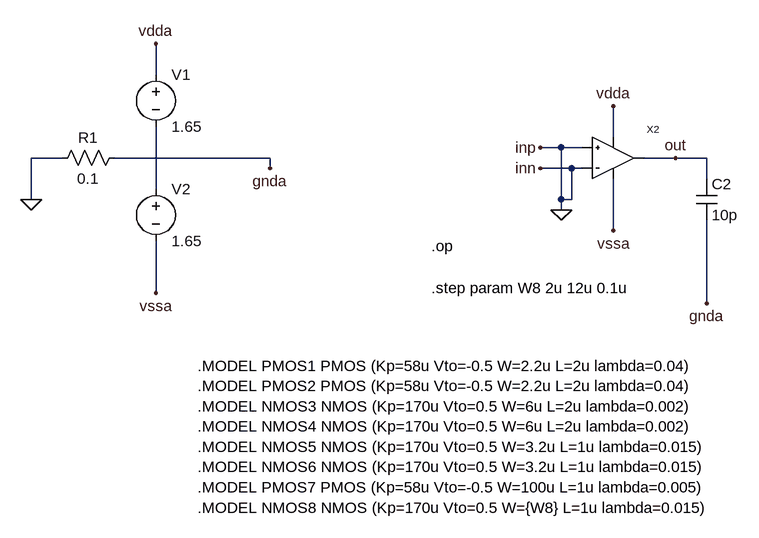
[diagram p0: schematic CMOSopamp-top.asc]
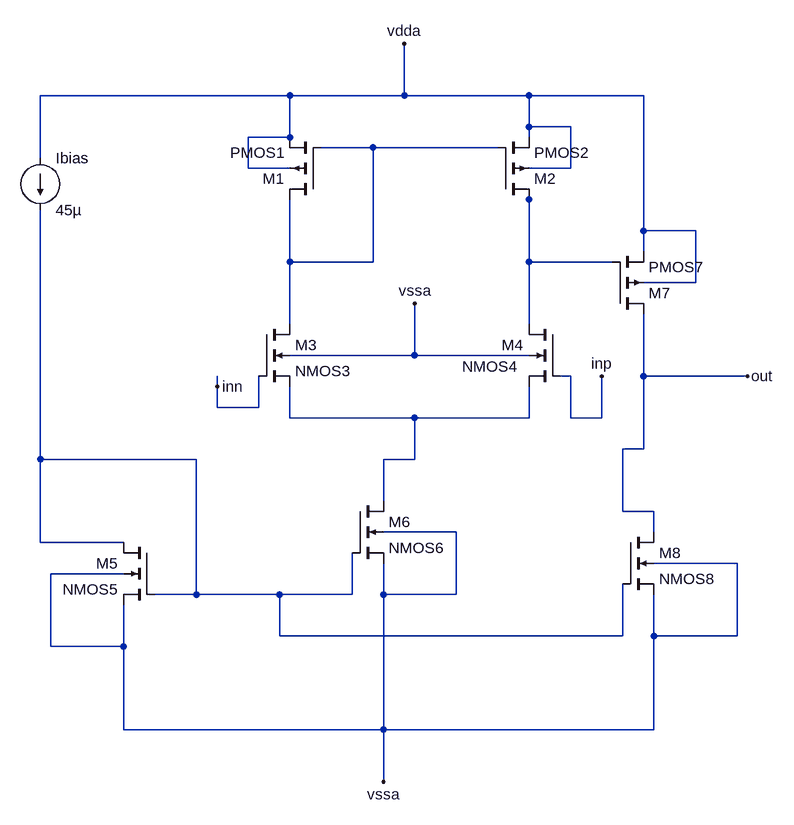
[diagram p1: sub-circuit cmosopamp.asc]
CMOSopamp-top.asc, the LTspice schematic file:
Version 4
SHEET 1 1400 740
WIRE 80 80 80 32
WIRE 784 176 784 128
WIRE 704 192 672 192
WIRE 736 192 704 192
WIRE -64 208 -112 208
WIRE 256 208 16 208
WIRE 880 208 832 208
WIRE 928 208 880 208
WIRE 256 224 256 208
WIRE 720 224 672 224
WIRE 736 224 720 224
WIRE 928 240 928 208
WIRE 80 256 80 160
WIRE -112 272 -112 208
WIRE 704 272 704 192
WIRE 720 272 720 224
WIRE 720 272 704 272
WIRE 704 288 704 272
WIRE 784 320 784 240
WIRE 80 416 80 336
WIRE 928 432 928 304
FLAG 80 32 vdda
FLAG 256 224 gnda
FLAG 80 416 vssa
FLAG -112 272 0
FLAG 928 432 gnda
FLAG 784 128 vdda
FLAG 784 320 vssa
FLAG 672 192 inp
FLAG 672 224 inn
FLAG 880 208 out
FLAG 704 288 0
SYMBOL voltage 80 64 R0
SYMATTR InstName V1
SYMATTR Value 1.65
SYMBOL voltage 80 240 R0
SYMATTR InstName V2
SYMATTR Value 1.65
SYMBOL res 32 192 R90
WINDOW 0 0 56 VBottom 2
WINDOW 3 32 56 VTop 2
SYMATTR InstName R1
SYMATTR Value 0.1
SYMBOL cap 912 240 R0
SYMATTR InstName C2
SYMATTR Value 10p
SYMBOL CMOSopamp 768 208 R0
SYMATTR InstName X2
TEXT 144 528 Left 2 !.MODEL PMOS1 PMOS (Kp=58u Vto=-0.5 W=2.2u L=2u lambda=0.04)\n.MODEL PMOS2 PMOS (Kp=58u Vto=-0.5 W=2.2u L=2u lambda=0.04)\n.MODEL NMOS3 NMOS (Kp=170u Vto=0.5 W=6u L=2u lambda=0.002)\n.MODEL NMOS4 NMOS (Kp=170u Vto=0.5 W=6u L=2u lambda=0.002)\n.MODEL NMOS5 NMOS (Kp=170u Vto=0.5 W=3.2u L=1u lambda=0.015)\n.MODEL NMOS6 NMOS (Kp=170u Vto=0.5 W=3.2u L=1u lambda=0.015)\n.MODEL PMOS7 PMOS (Kp=58u Vto=-0.5 W=100u L=1u lambda=0.005)\n.MODEL NMOS8 NMOS (Kp=170u Vto=0.5 W={W8} L=1u lambda=0.015)
TEXT 504 344 Left 2 !.op
TEXT 504 408 Left 2 !.step param W8 2u 12u 0.1u

cmosopamp.asc, the sub-circuit schematic file:
Version 4
SHEET 1 1080 1196
WIRE 320 16 -64 16
WIRE 496 16 496 -64
WIRE 496 16 320 16
WIRE 688 16 496 16
WIRE 864 16 688 16
WIRE 688 64 688 16
WIRE 752 64 688 64
WIRE 320 80 320 16
WIRE 320 80 256 80
WIRE 688 80 688 64
WIRE 448 96 368 96
WIRE 640 96 448 96
WIRE -64 112 -64 16
WIRE 256 128 256 80
WIRE 320 128 256 128
WIRE 752 128 752 64
WIRE 752 128 688 128
WIRE 688 176 688 160
WIRE 864 224 864 16
WIRE 944 224 864 224
WIRE 864 256 864 224
WIRE 320 272 320 176
WIRE 448 272 448 96
WIRE 448 272 320 272
WIRE 688 272 688 176
WIRE 816 272 688 272
WIRE 944 304 944 224
WIRE 944 304 864 304
WIRE 320 368 320 272
WIRE 688 368 688 272
WIRE 512 416 512 336
WIRE 512 416 320 416
WIRE 688 416 512 416
WIRE 752 448 736 448
WIRE 864 448 864 352
WIRE 1024 448 864 448
WIRE 208 464 208 448
WIRE 208 496 208 464
WIRE 272 496 272 448
WIRE 272 496 208 496
WIRE 320 512 320 464
WIRE 512 512 320 512
WIRE 688 512 688 464
WIRE 688 512 512 512
WIRE 752 512 752 448
WIRE 800 512 800 448
WIRE 800 512 752 512
WIRE 864 560 864 448
WIRE 864 560 832 560
WIRE -64 576 -64 192
WIRE 176 576 -64 576
WIRE 512 576 512 512
WIRE 512 576 464 576
WIRE 464 640 464 576
WIRE 832 656 832 560
WIRE 880 656 832 656
WIRE 576 688 464 688
WIRE 880 688 880 656
WIRE -64 704 -64 576
WIRE 64 704 -64 704
WIRE 1008 736 880 736
WIRE 64 752 -48 752
WIRE 176 784 176 576
WIRE 176 784 112 784
WIRE 304 784 176 784
WIRE 416 784 416 720
WIRE 416 784 304 784
WIRE 464 784 464 736
WIRE 576 784 576 688
WIRE 576 784 464 784
WIRE 304 848 304 784
WIRE 832 848 832 768
WIRE 832 848 304 848
WIRE 880 848 880 784
WIRE 1008 848 1008 736
WIRE 1008 848 880 848
WIRE -48 864 -48 752
WIRE 64 864 64 800
WIRE 64 864 -48 864
WIRE 64 992 64 864
WIRE 464 992 464 784
WIRE 464 992 64 992
WIRE 880 992 880 848
WIRE 880 992 464 992
WIRE 464 1072 464 992
FLAG 496 -64 vdda
FLAG 1024 448 out
FLAG 800 448 inp
FLAG 208 464 inn
FLAG 512 336 vssa
FLAG 464 1072 vssa
SYMBOL current -64 112 R0
WINDOW 123 0 0 Left 0
WINDOW 39 0 0 Left 0
SYMATTR InstName Ibias
SYMATTR Value 45µ
SYMBOL pmos4 368 176 R180
SYMATTR InstName M1
SYMATTR Value PMOS1
SYMBOL pmos4 640 176 M180
SYMATTR InstName M2
SYMATTR Value PMOS2
SYMBOL pmos4 816 352 M180
SYMATTR InstName M7
SYMATTR Value PMOS7
SYMBOL nmos4 272 368 R0
SYMATTR InstName M3
SYMATTR Value NMOS3
SYMBOL nmos4 736 368 M0
WINDOW 3 65 65 Left 2
SYMATTR Value NMOS4
SYMATTR InstName M4
SYMBOL nmos4 112 704 M0
SYMATTR InstName M5
SYMATTR Value NMOS5
SYMBOL nmos4 416 640 R0
SYMATTR InstName M6
SYMATTR Value NMOS6
SYMBOL nmos4 832 688 R0
SYMATTR InstName M8
SYMATTR Value NMOS8

The netlist it stands for:
* CMOSopamp-top.asc
V1 vdda N001 1.65
V2 N001 vssa 1.65
R1 gnda 0 0.1
C2 out gnda 10p
XX2 0 0 vdda vssa out cmosopamp

* block symbol definitions
.subckt cmosopamp inp inn vdda vssa out
Ibias vdda N004 45µ
M1 N001 N001 vdda vdda PMOS1
M2 N002 N001 vdda vdda PMOS2
M7 out N002 vdda vdda PMOS7
M3 N001 inn N003 vssa NMOS3
M4 N002 inp N003 vssa NMOS4
M5 N004 N004 vssa vssa NMOS5
M6 N003 N004 vssa vssa NMOS6
M8 out N004 vssa vssa NMOS8
.ends cmosopamp

.model NMOS NMOS
.model PMOS PMOS
.lib standard.mos
.MODEL PMOS1 PMOS (Kp=58u Vto=-0.5 W=2.2u L=2u lambda=0.04)
.MODEL PMOS2 PMOS (Kp=58u Vto=-0.5 W=2.2u L=2u lambda=0.04)
.MODEL NMOS3 NMOS (Kp=170u Vto=0.5 W=6u L=2u lambda=0.002)
.MODEL NMOS4 NMOS (Kp=170u Vto=0.5 W=6u L=2u lambda=0.002)
.MODEL NMOS5 NMOS (Kp=170u Vto=0.5 W=3.2u L=1u lambda=0.015)
.MODEL NMOS6 NMOS (Kp=170u Vto=0.5 W=3.2u L=1u lambda=0.015)
.MODEL PMOS7 PMOS (Kp=58u Vto=-0.5 W=100u L=1u lambda=0.005)
.MODEL NMOS8 NMOS (Kp=170u Vto=0.5 W={W8} L=1u lambda=0.015)
.op
.step param W8 2u 12u 0.1u
.backanno
.end